# EAGLE design BME280_Daughter_1_1 (EAGLE 8.2.1)
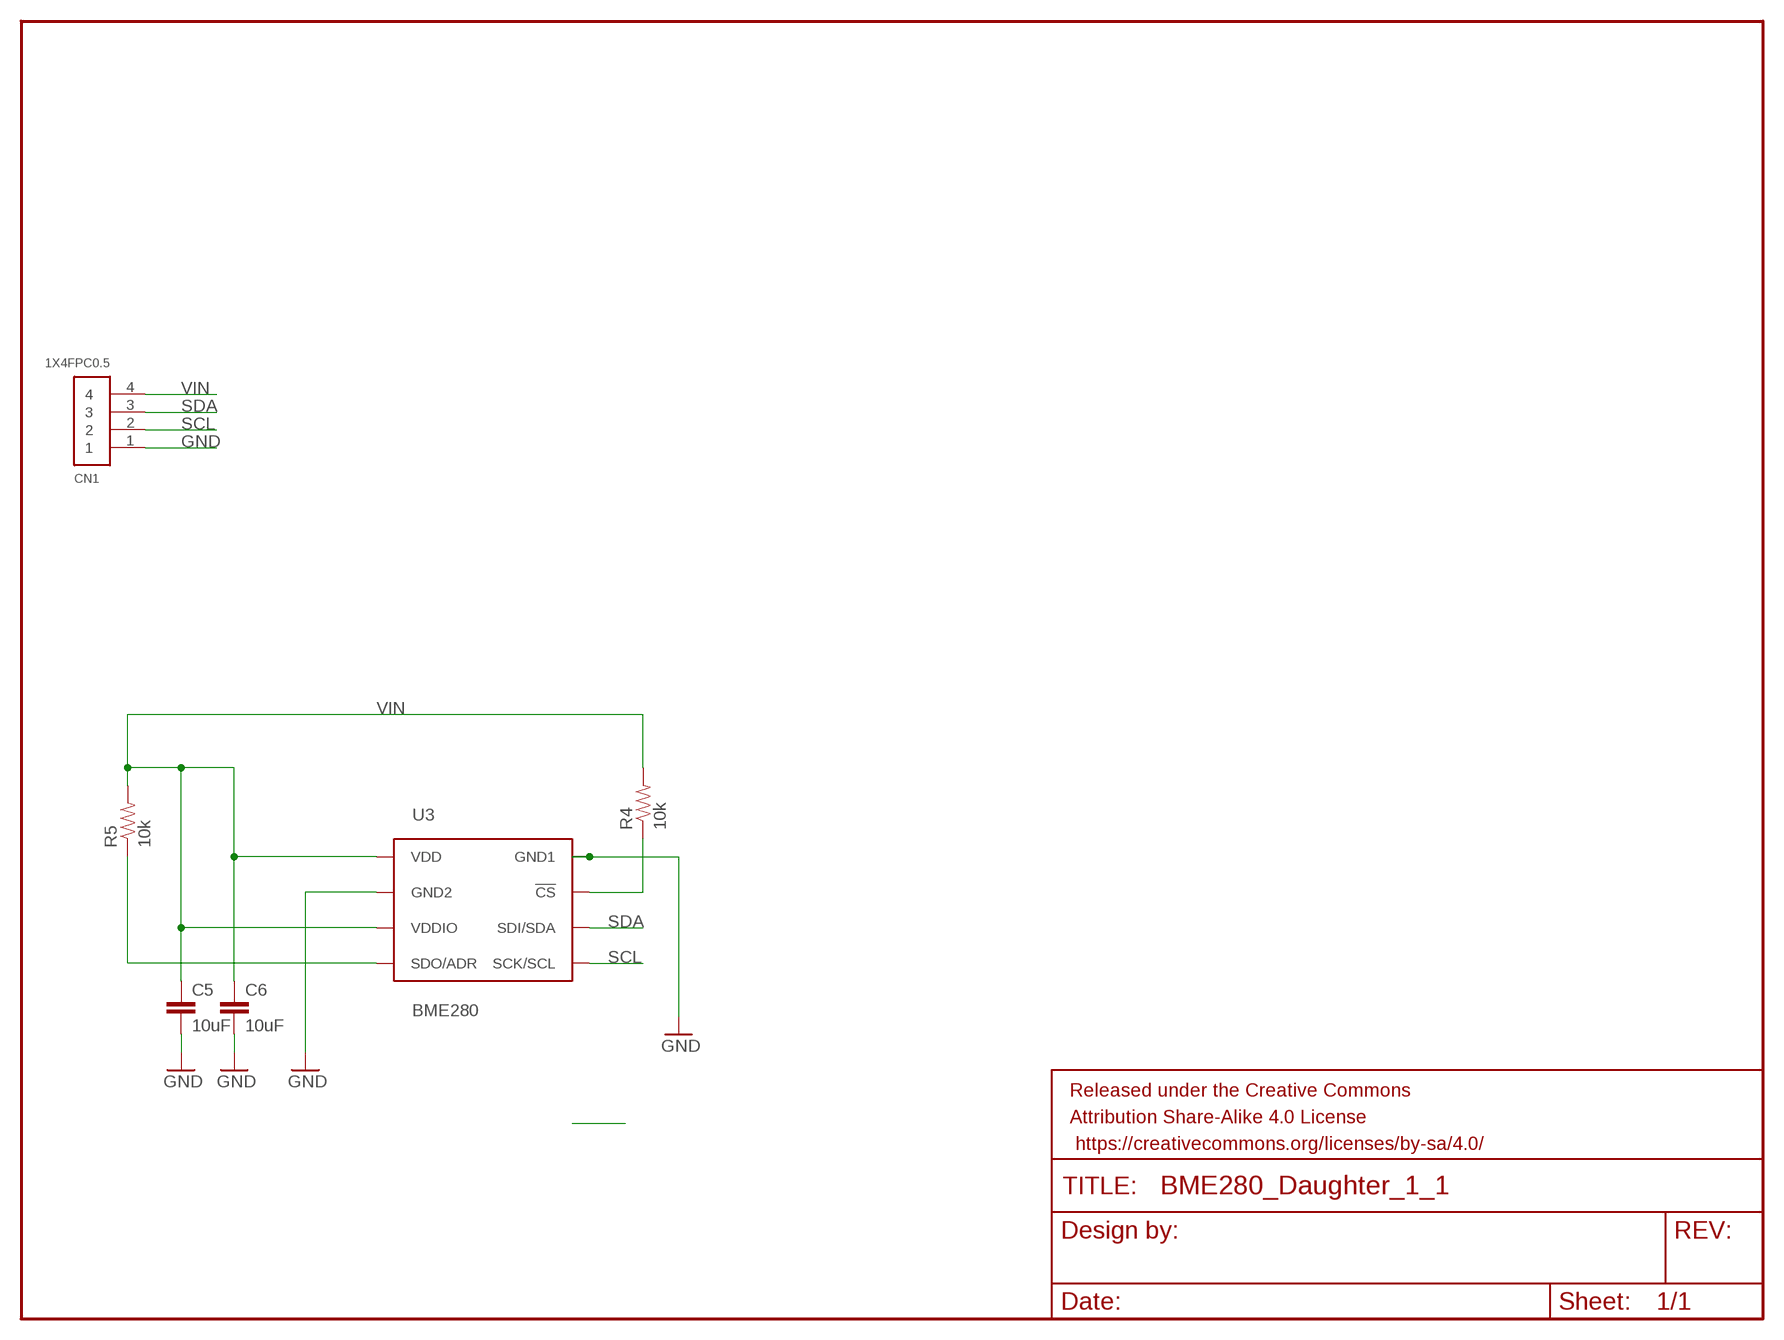
[diagram p0: schematic, sheet 1]

## Parts
C5  10uF  CAP0805  [0805]
C6  10uF  CAP0805  [0805]
CN1  1X4FPC0.5  [FPC_0.5MM-4]
FRAME1  FRAME-LETTER  [CREATIVE_COMMONS]
R4  10k  RESISTOR0805-RES  [0805]
R5  10k  RESISTOR0805-RES  [0805]
U3  BME280  [BME280_LGA]

## Nets
GND: C5.2 C6.2 CN1.1 U3.P$1(GND1) U3.P$7(GND2)
N$5: R4.1 U3.P$2(!CS)
N$17: R5.1 U3.P$5(SDO/ADR)
SCL: CN1.2 U3.P$4(SCK/SCL)
SDA: CN1.3 U3.P$3(SDI/SDA)
VIN: C5.1 C6.1 CN1.4 R4.2 R5.2 U3.P$6(VDDIO) U3.P$8(VDD)

## Library data of the parts
C5 C6 = SparkFun-Capacitors:CAP: Capacitor Standard 0603 ceramic capacitor, and 0.1" leaded capacitor.
CN1 = adafruit:1X4: 4-pin connector
FRAME1 = SparkFun-Aesthetics:FRAME-LETTER: Schematic Frame Standard 8.5x11 US Letter frame
R4 R5 = SparkFun-Passives:RESISTOR: Resistor Basic schematic elements and footprints for 0603, 1206, and PTH resistors.
U3 = BME280ComponentLibrary:BME280; PROD_ID: IC-13090

## Board
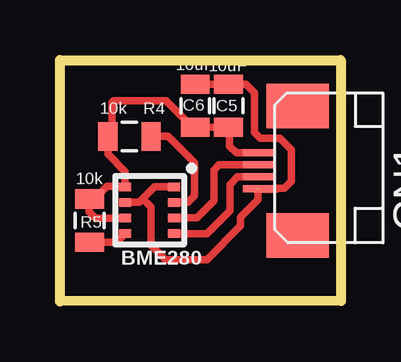
[diagram p1: board, top side]

Size 11.72 x 10.07 mm. Coordinates in mm from the lower left corner, seen from the top.
Outline: 0,0 0.01,10.07 11.71,10.07 11.72,0.02 0.02,0.04
Copper layers (1*16): Top 0.035mm / dielectric 1.5mm / Bottom 0.035mm
Design rules "SparkFun": minimum track width 8mil, minimum drill 20mil, track to track 8mil, track to pad 8mil, pad to pad 8mil, via to via 8mil, smd to smd 8mil, copper to edge 8mil, drill to drill 8mil, minimum pad ring 12mil, minimum via ring 10mil, stop-mask expansion 4mil, vias tented up to drill 20mil, thermal gap 10mil

### Footprints (pad centres in the part's own frame; a part is rotated, then mirrored left to right if it is on the bottom)
0805 = smd 0.8 x 1.2: 1 -0.9,0; 2 0.9,0
FPC_0.5MM-4 = smd 0.3 x 1.25: 1 -0.75,-0.45; 2 -0.25,-0.45; 3 0.25,-0.45; 4 0.75,-0.45 | smd 1.85 x 2.6: MT -2.7,-2.1; MT2 2.7,-2.1
BME280_LGA = smd 0.5 x 0.35: P$1 1.025,0.975; P$2 1.025,0.325; P$3 1.025,-0.325; P$4 1.025,-0.975; P$5 -1.025,-0.975; P$6 -1.025,-0.325; P$7 -1.025,0.325; P$8 -1.025,0.975

### Placement (x,y rotation side)
C5  7.04,8.17 90 top
C6  5.64,8.16 90 top
CN1  7.82,5.45 90 top
FRAME1  21.27,-9.18 0 top  (outside the outline)
R4  2.9,6.88 180 top
R5  1.24,3.38 90 top
U3  3.75,3.81 0 top

### Tracks (layer width: path | path; a pad name or v marks a point on that pad's centre or on a via)
GND  (1 unrouted)
  Top 0.305: 4.75,4.8 U3.P$1 3.95,4.78 3.45,4.28 | U3.P$7 3.31,4.13 3.45,4.28 | C6.2 C5.2 7.75,9.07 8.12,8.7 8.12,7.06 8.37,6.81 9.17,6.81 9.65,6.33 9.65,5.01 9.36,4.72 9.07,4.72 9.04,4.69 CN1.1 | CN1.1 8.27,4.25 7.54,3.52 7.54,3.16 6.13,1.75 4.4,1.75 3.8,2.35 3.8,3.93 3.45,4.28
N$5
  Top 0.305: U3.P$2 5.34,4.14 5.61,4.41 5.61,5.79 4.51,6.88 R4.1
N$17
  Top 0.305: R5.1 2.36,2.48 U3.P$5
SCL
  Top 0.305: 5.44,2.84 5.59,2.84 | 5.44,2.84 U3.P$4 | CN1.2 7.41,5.2 7.09,4.88 7.09,3.79 7.03,3.73 7.03,3.72 6.14,2.83 5.45,2.83 5.44,2.84
SDA
  Top 0.305: U3.P$3 4.79,3.5 5.36,3.5 5.71,3.5 6.42,4.21 6.42,5.48 6.64,5.7 CN1.3
VIN
  Top 0.305: 2.71,4.8 1.96,4.8 1.43,4.28 R5.2 1.22,4.25 1.22,3.74 1.48,3.48 1.58,3.48 U3.P$6 | 2.71,4.8 U3.P$8 | 2.71,4.8 2.72,4.82 2.72,5.42 2,6.14 R4.2 2.17,7.05 2.17,8.31 2.24,8.38 4.42,8.38 5.54,7.26 C6.1 C5.1 7.08,7.22 7.08,6.48 7.36,6.2 CN1.4